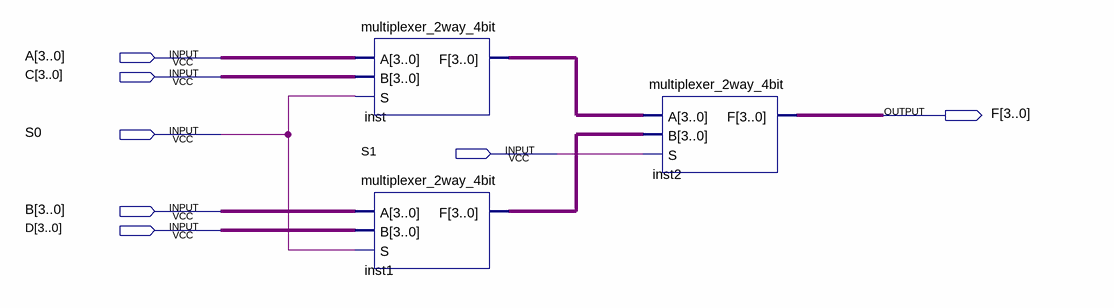
[diagram p0: schematic sheet]
// Quartus schematic multiplexer_4way_4bit.bdf as structural Verilog: 3 symbols, 7 pins
module multiplexer_4way_4bit (
  input  [3:0] A,
  input  [3:0] C,
  input  S0,
  input  S1,
  input  [3:0] B,
  input  [3:0] D,
  output [3:0] F
);

  wire [3:0] inst1_f, inst_f;

  multiplexer_2way_4bit inst (.A(A), .B(C), .S(S0), .F(inst_f));
  multiplexer_2way_4bit inst1 (.A(B), .B(D), .S(S0), .F(inst1_f));
  multiplexer_2way_4bit inst2 (.A(inst_f), .B(inst1_f), .S(S1), .F(F));
endmodule
